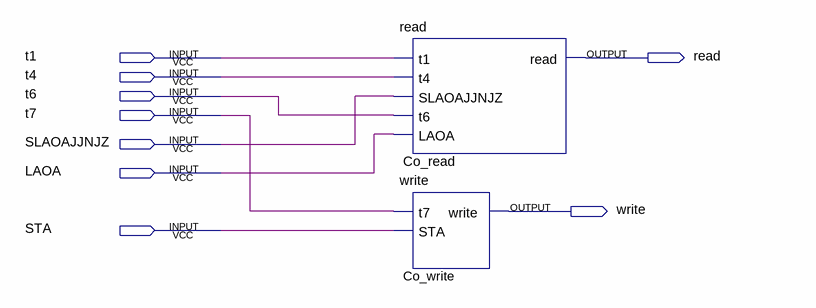
[diagram p0: schematic sheet]
// Quartus schematic uc_io.bdf as structural Verilog: 2 symbols, 9 pins
module uc_io (
  input  t1,
  input  t4,
  input  t6,
  input  t7,
  input  SLAOAJJNJZ,
  input  LAOA,
  input  STA,
  output read,
  output write
);

  read Co_read (.t1(t1), .t4(t4), .SLAOAJJNJZ(SLAOAJJNJZ), .t6(t6), .LAOA(LAOA), .read(read));
  write Co_write (.t7(t7), .STA(STA), .write(write));
endmodule
